# Altium project PCB_Project.PrjPcb
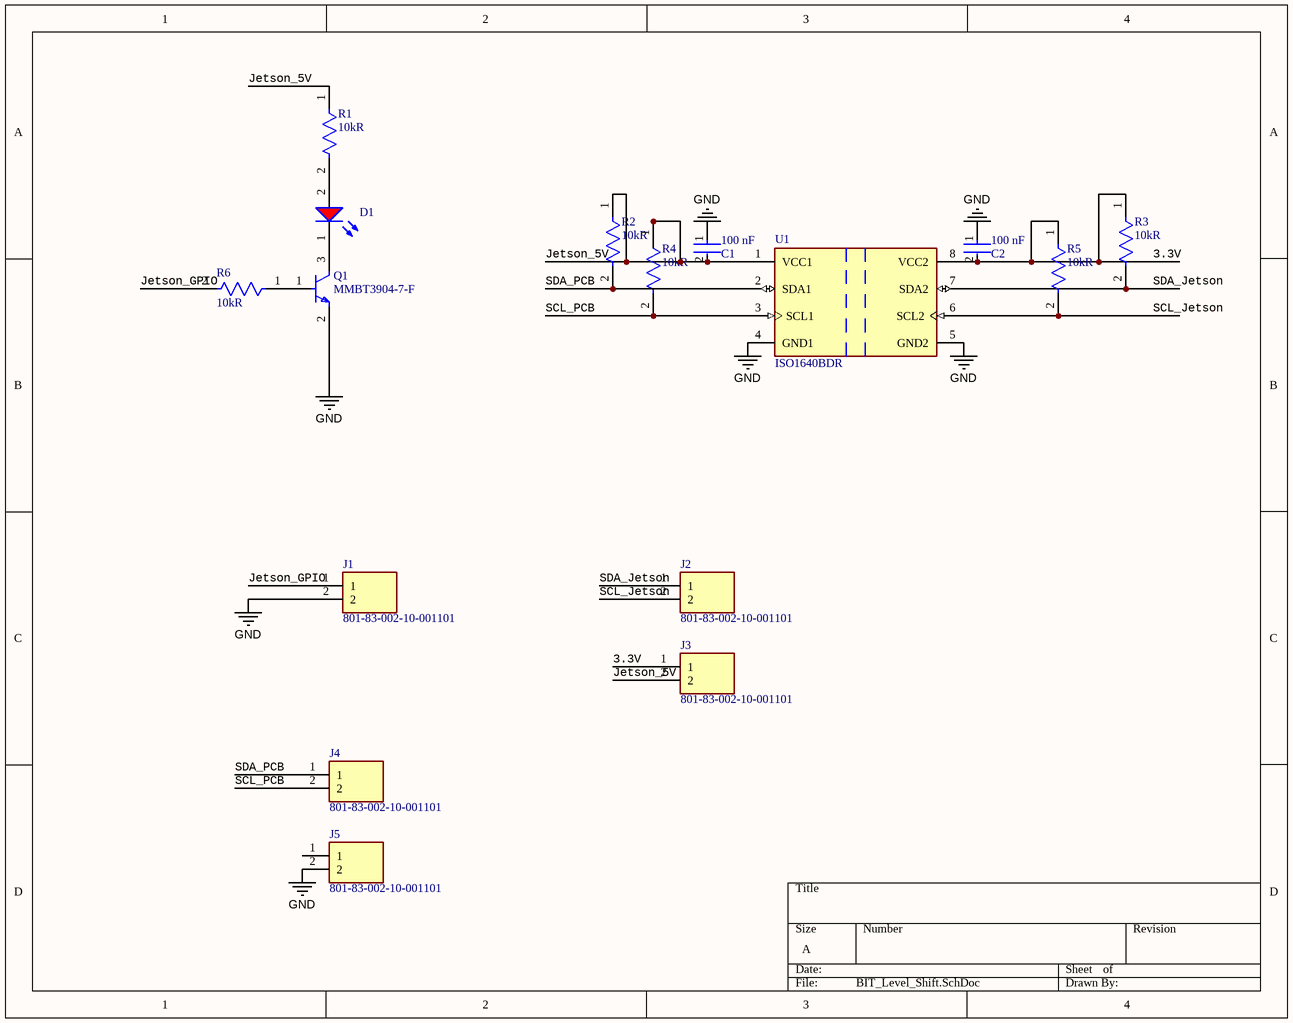
[diagram p0: BIT_Level_Shift.SchDoc]
1 sheet, 16 parts. Net scope: global (net labels, ports and power ports of the same name join across sheets).
Board file: BIT_Level_Shift.PcbDoc

## Sheet BIT_Level_Shift.SchDoc
size A; SheetNumber: 1; SheetTotal: 1

### Parts
C1  Capacitance: 100 nF  [FP-CC0805-0_85-MFG]  (hidden comment: CC0805KRX7R9BB104)
C2  Capacitance: 100 nF  [FP-CC0805-0_85-MFG]  (hidden comment: CC0805KRX7R9BB104)
D1  150080RS75000  [WL-SMCW_0805_150080xx75000]  (value not drawn)
J1  801-83-002-10-001101  [RHDR2W60P0X254_1X2_508X254X700P]
J2  801-83-002-10-001101  [RHDR2W60P0X254_1X2_508X254X700P]
J3  801-83-002-10-001101  [RHDR2W60P0X254_1X2_508X254X700P]
J4  801-83-002-10-001101  [RHDR2W60P0X254_1X2_508X254X700P]
J5  801-83-002-10-001101  [RHDR2W60P0X254_1X2_508X254X700P]
Q1  MMBT3904-7-F  [FP-SOT23-IPC_A]
R1  Resistance: 10kR  [FP-RR1220-IPC_A]  (hidden comment: RR1220P-103-D)
R2  Resistance: 10kR  [FP-RR1220-IPC_A]  (hidden comment: RR1220P-103-D)
R3  Resistance: 10kR  [FP-RR1220-IPC_A]  (hidden comment: RR1220P-103-D)
R4  Resistance: 10kR  [FP-RR1220-IPC_A]  (hidden comment: RR1220P-103-D)
R5  Resistance: 10kR  [FP-RR1220-IPC_A]  (hidden comment: RR1220P-103-D)
R6  Resistance: 10kR  [FP-RR1220-IPC_A]  (hidden comment: RR1220P-103-D)
U1  ISO1640BDR  [FP-D0008A-IPC_C]

### Nets
GND: C1.1 C2.1 J1.2 J5.2 Q1.2(E) U1.4(GND1) U1.5(GND2)
3.3V: C2.2 J3.1 R3.1 R5.1 U1.8(VCC2)
Jetson_5V: C1.2 J3.2 R1.1 R2.1 R4.1 U1.1(VCC1)
Jetson_GPIO: J1.1 R6.2
SCL_Jetson: J2.2 R5.2 U1.6(SCL2)
SCL_PCB: J4.2 R4.2 U1.3(SCL1)
SDA_Jetson: J2.1 R3.2 U1.7(SDA2)
SDA_PCB: J4.1 R2.2 U1.2(SDA1)
NetD1_1: D1.1(K) Q1.3(C)
NetD1_2: D1.2(A) R1.2
NetQ1_1: Q1.1(B) R6.1

Not connected (* = marked no-connect by the designer): J5 1

### Library data of the parts
C1 C2 = CMP-2100-03606-3: CAP CER 0.1UF 50V X7R 0805; Manufacturer: Yageo; Tolerance: 0.1; Value: 100 nF; Material: Ceramic; Device Class L1: Passive Components; ComponentLink2Description: Datasheet; Package: CC0805-0.85; Manufacturer Part Number: CC0805KRX7R9BB104; Digikey Description: CAP CER 0.1UF 50V X7R 0805; Device Class L3: Ceramic Capacitors; Temperature: -30°C to +85°C; Temperature Characteristic: X7R; Voltage Rating: 50 V; Height: 0.95mm; RoHS: TRUE; Ipc Land Pattern Name: CAPC200125X85; Device Class L2: Capacitors; Category: Cap; Temperature Range Low: -30°C; Temperature Range High: +85°C; Mouser Description: Multilayer Ceramic Capacitors MLCC - SMD/SMT 100nF 50V X7R 10%; Footprint Url: http://www.yageo.com/exep/pages/download/literatures/UPY-C_GEN_24.pdf; Automotive: No; Octopart: https://octopart.com/cc0805krx7r9bb104-yageo-192993; Lead Free: Yes; ComponentLink2URL: http://www.yageo.com/documents/recent/UPY-GPHC_Y5V_6.3V-to-50V_8.pdf
D1 = CMP-1426-00011-3: LED Uni-Color Red 630nm 2-Pin Chip 0805(2012Metric) T/R; Viewing Angle: 140°; Max Junction Temperature (Tj): 95°C; Power Dissipation: 72mW; Forward Current: 100mA; Forward Voltage: 2V; Wavelength: 625nm; Test Current: 20mA; Max Reverse Voltage (DC): 5V; Luminous Intensity: 150mcd; Lens Style: Clear, Rectangular; REACH SVHC: Unknown; Height: 700µm; Case Code (Metric): 2012; Peak Wavelength: 630nm; Length: 2mm; Width: 1.25mm; RoHS: Compliant; Packaging: Tape and Reel; Dominant Wavelength: 625nm; Color: Red; Case Code (Imperial): 0805; Min Operating Temperature: -40°C; Mount: Surface Mount; Max Operating Temperature: 85°C; Case/Package: 0805
J1-J5 = 801-83-002-10-001101: Connector; Manufacturer_Name: Preci-Dip; Datasheet Link: https://www.precidip.com/AppHost/9696,1/Scripts/Modules/Catalog/Default.aspx?c=7&i=310&p=107&pdf=1&dsku=801-PP-NNN-10-001101; Height: 7mm; Manufacturer_Part_Number: 801-83-002-10-001101; Mouser Part Number: 437-8018300210001101; Mouser Price/Stock: https://www.mouser.co.uk/ProductDetail/Preci-dip/801-83-002-10-001101?qs=FtMuP6KVi2SapQB4HbL8Ng%3D%3D
Q1 = CMP-2000-04931-2: TRANS NPN 40V 0.2A SMD SOT23-3; Frequency: 300MHz; Power Dissipation: 350mW; Element Configuration: Single; Max Power Dissipation: 300mW; Max Collector Current: 200mA; Collector Emitter Saturation Voltage: 300mV; Number of Elements: 1; hFE Min: 100; Collector Base Voltage (VCBO): 60V; Emitter Base Voltage (VEBO): 6V; Contact Plating: Tin; Package Quantity: 3000; Max Frequency: 300MHz; REACH SVHC: No SVHC; Max Operating Temperature: 150°C; Width: 1.4mm; Collector Emitter Voltage (VCEO): 40V; Voltage Rating (DC): 40V; Radiation Hardening: No; Case/Package: SOT-23; Height: 1mm; Collector Emitter Breakdown Voltage: 40V; Length: 3.05mm; Polarity: NPN; Packaging: Tape and Reel; Number of Pins: 3; Min Operating Temperature: -55°C; Gain Bandwidth Product: 300MHz; Mount: Surface Mount; Weight: 0.000282oz; Continuous Collector Current: 200mA; Transition Frequency: 300MHz; Max Breakdown Voltage: 40V; Lead Free: Lead Free
R1-R6 = CMP-2001-03215-2: 10kΩ ±0.5% 0.1W 1/10W Chip Resistor 0805 (2012 Metric) Thin Film; Max Power Dissipation: 100mW; Voltage Rating: 100V; Temperature Coefficient: 25ppm/°C; Size Code: 0805; RoHS Compliant: Yes; Package Quantity: 1; Resistance Tolerance: 0.5%; Depth: 1.25mm; Lead Free: Lead Free; Series: RR; Min Operating Temperature: -55°C; Weight: 0.000194oz; Width: 1.25mm; Packaging: Tape and Reel; Termination: SMD/SMT; Length: 2mm; Power Rating: 100mW; Case Code (Metric): 2012; Resistor Type: Thin Film; Height: 0.4mm; Case/Package: 0805; Case Code (Imperial): 0805; Technology: THIN FILM; Max Operating Temperature: 125°C; Voltage Rating (DC): 100V; Number of Terminations: 2; Tolerance: 0.5%
U1 = CMP-04872-000071-1: ROBUST-EMC BIDIRECTIONAL I2C DIG; RoHS Compliant: Yes